# Altium project wifigyro.PrjPCB
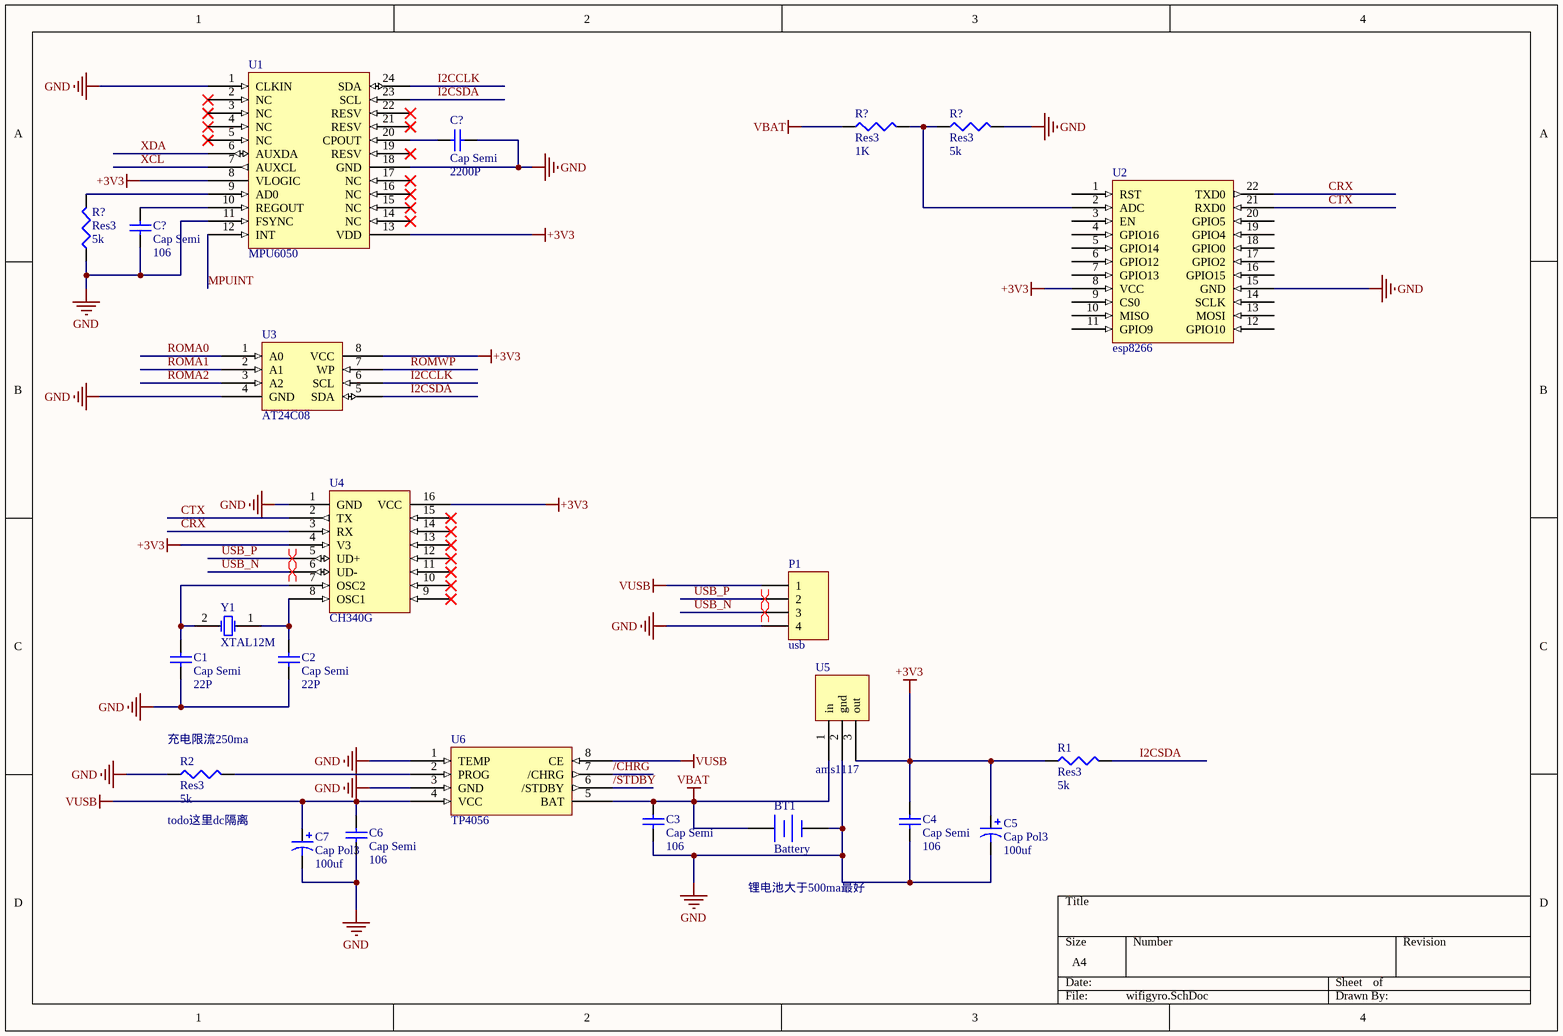
[diagram p0: wifigyro.SchDoc]
1 sheet, 23 parts. Net scope: global (net labels, ports and power ports of the same name join across sheets).

## Sheet wifigyro.SchDoc
size A4

### Parts
(Parts that share a designator on the sheet are numbered #1, #2 ... from top to bottom, then left to right.)
BT1  Battery  [BAT-2]
C1  Cap Semi  value 22P  [C1206]
C2  Cap Semi  value 22P  [C1206]
C3  Cap Semi  value 106  [C1206]
C4  Cap Semi  value 106  [C1206]
C5  Cap Pol3  value 100uf  [C0805]
C6  Cap Semi  value 106  [C1206]
C7  Cap Pol3  value 100uf  [C0805]
C?#1  Cap Semi  value 2200P  [C1206]
C?#2  Cap Semi  value 106  [C1206]
P1  usb  [HDR1X4]
R1  Res3  value 5k  [J1-0603]
R2  Res3  value 5k  [J1-0603]
R?#1  Res3  value 1K  [J1-0603]
R?#2  Res3  value 5k  [J1-0603]
R?#3  Res3  value 5k  [J1-0603]
U1  MPU6050
U2  esp8266
U3  AT24C08
U4  CH340G
U5  ams1117
U6  TP4056
Y1  XTAL12M  [R38]

### Nets
+3V3: C4.2 C5.1 R1.1 U1.8(VLOGIC) U1.13(VDD) U2.8(VCC) U3.8(VCC) U4.4(V3) U4.16(VCC) U5.3(out)
GND: BT1.2(-) C1.1 C2.1 C3.1 C4.1 C5.2 C6.1 C7.2 C?#1.1 C?#2.1 P1.4 R2.1 R?#2.2 R?#3.1 U1.1(CLKIN) U1.11(FSYNC) U1.18(GND) U2.15(GND) U3.4(GND) U4.1(GND) U5.2(gnd) U6.1(TEMP) U6.3(GND)
VBAT: BT1.1(+) C3.2 R?#1.1 U5.1(in) U6.5(BAT)
VUSB: C6.2 C7.1 P1.1 U6.4(VCC) U6.8(CE)
/CHRG: U6.7(/CHRG)
/STDBY: U6.6(/STDBY)
CRX: U2.22(TXD0) U4.3(RX)
CTX: U2.21(RXD0) U4.2(TX)
I2CCLK: U1.24(SDA) U3.6(SCL)
I2CSDA: R1.2 U1.23(SCL) U3.5(SDA)
MPUINT: U1.12(INT)
ROMA0: U3.1(A0)
ROMA1: U3.2(A1)
ROMA2: U3.3(A2)
ROMWP: U3.7(WP)
USB_N: P1.3 U4.6(UD-)
USB_P: P1.2 U4.5(UD+)
XCL: U1.7(AUXCL)
XDA: U1.6(AUXDA)
NetC1_2: C1.2 U4.7(OSC2) Y1.2(OSC2)
NetC2_2: C2.2 U4.8(OSC1) Y1.1(OSC1)
NetC?#1_2: C?#1.2 U1.20(CPOUT)
NetC?#2_2: C?#2.2 U1.10(REGOUT)
NetR2_2: R2.2 U6.2(PROG)
NetR?#1_2: R?#1.2 R?#2.1 U2.2(ADC)
NetR?#3_2: R?#3.2 U1.9(AD0)

Not connected (* = marked no-connect by the designer): U1 2(NC)* 3(NC)* 4(NC)* 5(NC)* 14(NC)* 15(NC)* 16(NC)* 17(NC)* 19(RESV)* 21(RESV)* 22(RESV)*; U2 1(RST) 3(EN) 4(GPIO16) 5(GPIO14) 6(GPIO12) 7(GPIO13) 9(CS0) 10(MISO) 11(GPIO9) 12(GPIO10) 13(MOSI) 14(SCLK) 16(GPIO15) 17(GPIO2) 18(GPIO0) 19(GPIO4) 20(GPIO5); U4 9* 10* 11* 12* 13* 14* 15*

### Layout directives
differential pair: USB_N, USB_P

### Notes on the sheet
- (near R2) 充电限流250ma
- (near R2) todo这里dc隔离
- 锂电池大于500ma最好

### Library data of the parts
BT1 = Battery: Multicell Battery; Published: 24-Mar-1999; LatestRevisionDate: 17-Jul-2002; LatestRevisionNote: Re-released for DXP Platform.; PackageReference: BAT-2; Publisher: Altium Limited; PackageDescription: Battery; 2 Leads
C1-C4 C6 C?#1 C?#2 = Cap Semi: Capacitor (Semiconductor SIM Model); Published: 8-Jun-2000; LatestRevisionDate: 29-May-2009; LatestRevisionNote: IPC-7351 Footprint Added.; PackageReference: C1206; Publisher: Altium Limited; PackageDescription: Chip Capacitor
C5 C7 = Cap Pol3: Polarized Capacitor (Surface Mount); Published: 8-Jun-2000; LatestRevisionDate: 29-May-2009; LatestRevisionNote: IPC-7351 Footprint Added.; PackageReference: C0805; Publisher: Altium Limited; PackageDescription: Chip Capacitor
P1 = Header 4: Header, 4-Pin; LatestRevisionDate: 17-Jul-2002; LatestRevisionNote: Re-released for DXP Platform.; Publisher: Altium Limited
R1 R2 R?#1-R?#3 = Res3: Resistor; Published: 8-Jun-2000; LatestRevisionDate: 29-May-2009; LatestRevisionNote: IPC-7351 Footprint Added.; PackageReference: J1-0603; Publisher: Altium Limited; PackageDescription: Chip Resistor
Y1 = XTAL: Crystal Oscillator; Published: 8-Jun-2000; LatestRevisionDate: 17-Jul-2002; LatestRevisionNote: Re-released for DXP Platform.; PackageReference: R38; Publisher: Altium Limited; PackageDescription: Crystal, Thru-Hole; 2 Leads; Body 3.1 x 8.2 mm (Dia.xH)